# Altium schematic sheet Sheet1.SchDoc
size A
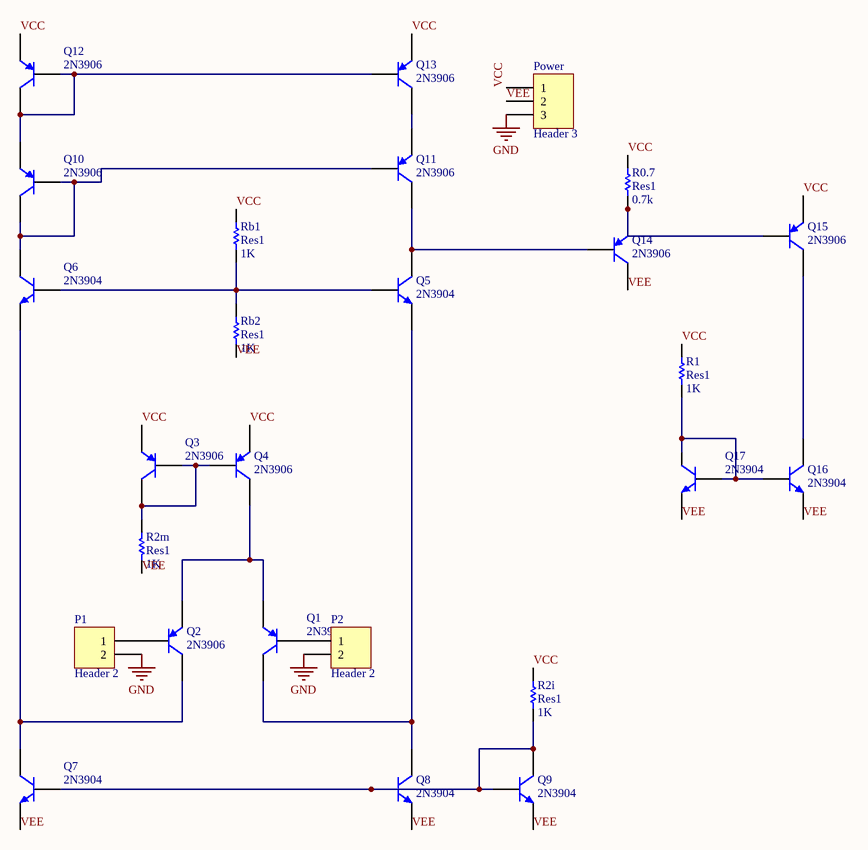
[diagram p0: Sheet1.SchDoc]

## Parts
P1  Header 2  [HDR1X2]
P2  Header 2  [HDR1X2]
Power  Header 3  [HDR1X3]
Q1  2N3906  [TO-92A]
Q2  2N3906  [TO-92A]
Q3  2N3906  [TO-92A]
Q4  2N3906  [TO-92A]
Q5  2N3904  [TO-92A]
Q6  2N3904  [TO-92A]
Q7  2N3904  [TO-92A]
Q8  2N3904  [TO-92A]
Q9  2N3904  [TO-92A]
Q10  2N3906  [TO-92A]
Q11  2N3906  [TO-92A]
Q12  2N3906  [TO-92A]
Q13  2N3906  [TO-92A]
Q14  2N3906  [TO-92A]
Q15  2N3906  [TO-92A]
Q16  2N3904  [TO-92A]
Q17  2N3904  [TO-92A]
R0.7  Res1  value 0.7k  [AXIAL-0.3]
R1  Res1  value 1K  [AXIAL-0.3]
R2i  Res1  value 1K  [AXIAL-0.3]
R2m  Res1  value 1K  [AXIAL-0.3]
Rb1  Res1  value 1K  [AXIAL-0.3]
Rb2  Res1  value 1K  [AXIAL-0.3]

## Nets
GND: P1.2 P2.2 Power.3
VCC: Power.1 Q3.1(E) Q4.1(E) Q12.1(E) Q13.1(E) Q15.1(E) R0.7.2 R1.2 R2i.2 Rb1.2
VEE: Power.2 Q7.1(E) Q8.1(E) Q9.1(E) Q14.3(C) Q16.1(E) Q17.1(E) R2m.1 Rb2.1
NetP1_1: P1.1 Q2.2(B)
NetP2_1: P2.1 Q1.2(B)
NetQ1_1: Q1.1(E) Q2.1(E) Q4.3(C)
NetQ1_3: Q1.3(C) Q5.1(E) Q8.3(C)
NetQ2_3: Q2.3(C) Q6.1(E) Q7.3(C)
NetQ3_2: Q3.2(B) Q3.3(C) Q4.2(B) R2m.2
NetQ5_2: Q5.2(B) Q6.2(B) Rb1.1 Rb2.2
NetQ5_3: Q5.3(C) Q11.3(C) Q14.2(B)
NetQ6_3: Q6.3(C) Q10.2(B) Q10.3(C) Q11.2(B)
NetQ7_2: Q7.2(B) Q8.2(B) Q9.2(B) Q9.3(C) R2i.1
NetQ10_1: Q10.1(E) Q12.2(B) Q12.3(C) Q13.2(B)
NetQ11_1: Q11.1(E) Q13.3(C)
NetQ14_1: Q14.1(E) Q15.2(B) R0.7.1
NetQ15_3: Q15.3(C) Q16.3(C)
NetQ16_2: Q16.2(B) Q17.2(B) Q17.3(C) R1.1

## Library data of the parts
P1 P2 = Header 2: Header, 2-Pin; LatestRevisionDate: 17-Jul-2002; LatestRevisionNote: Re-released for DXP Platform.; Publisher: Altium Limited
Power = Header 3: Header, 3-Pin; LatestRevisionDate: 17-Jul-2002; LatestRevisionNote: Re-released for DXP Platform.; Publisher: Altium Limited
Q1-Q4 Q10-Q15 = 2N3906: PNP General Purpose Amplifier; Published: 8-Jun-2000; LatestRevisionDate: 15-Jan-2003; LatestRevisionNote: PCB Footprint 'BCY-W3/D4.7' replaced; DatasheetVersion: 1997; PackageVersion: Sep-1998; PackageReference: TO-92A; Publisher: Altium Limited; PackageDescription: TO, Flat Index; 3 In-Line, Axial Leads; Body Dia. 4.5mm; Leads 0.51 x 0.48 mm (max); ComponentLink1Description: Manufacturer Link; ComponentLink1URL: http://www.fairchildsemi.com/; ComponentLink2Description: Datasheet; ComponentLink2URL: http://www.fairchildsemi.com/ds/2N%2F2N3906.pdf
Q5-Q9 Q16 Q17 = 2N3904: NPN General Purpose Amplifier; Published: 8-Jun-2000; LatestRevisionDate: 15-Jan-2003; LatestRevisionNote: PCB Footprint 'BCY-W3/D4.7' replaced; DatasheetVersion: 1997; PackageVersion: Sep-1998; PackageReference: TO-92A; Publisher: Altium Limited; PackageDescription: TO, Flat Index; 3 In-Line, Axial Leads; Body Dia. 4.5mm; Leads 0.51 x 0.48 mm (max); ComponentLink1Description: Manufacturer Link; ComponentLink1URL: http://www.fairchildsemi.com/; ComponentLink2Description: Datasheet; ComponentLink2URL: http://www.fairchildsemi.com/ds/2N%2F2N3904.pdf
R0.7 R1 R2i R2m Rb1 Rb2 = Res1: Resistor; Published: 8-Jun-2000; LatestRevisionDate: 17-Jul-2002; LatestRevisionNote: Re-released for DXP Platform.; PackageReference: AXIAL-0.3; Publisher: Altium Limited; PackageDescription: Axial Device, Thru-Hole; 2 Leads; 0.3 in Pin Spacing